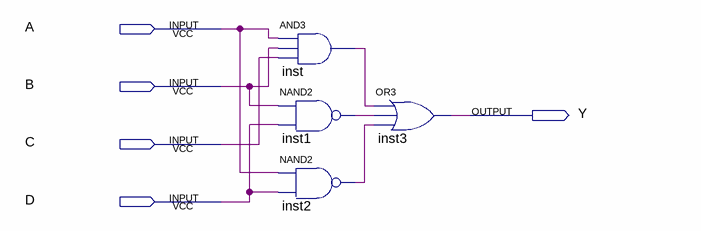
[diagram p0: schematic sheet]
// Quartus schematic lab1_1.bdf as structural Verilog: 4 symbols, 5 pins
module lab1_1 (
  input  A,
  input  B,
  input  C,
  input  D,
  output Y
);

  wire inst1_out, inst2_out, inst_out;

  and inst (inst_out, A, B, C);
  nand inst1 (inst1_out, B, D);
  nand inst2 (inst2_out, A, D);
  or inst3 (Y, inst_out, inst1_out, inst2_out);
endmodule
